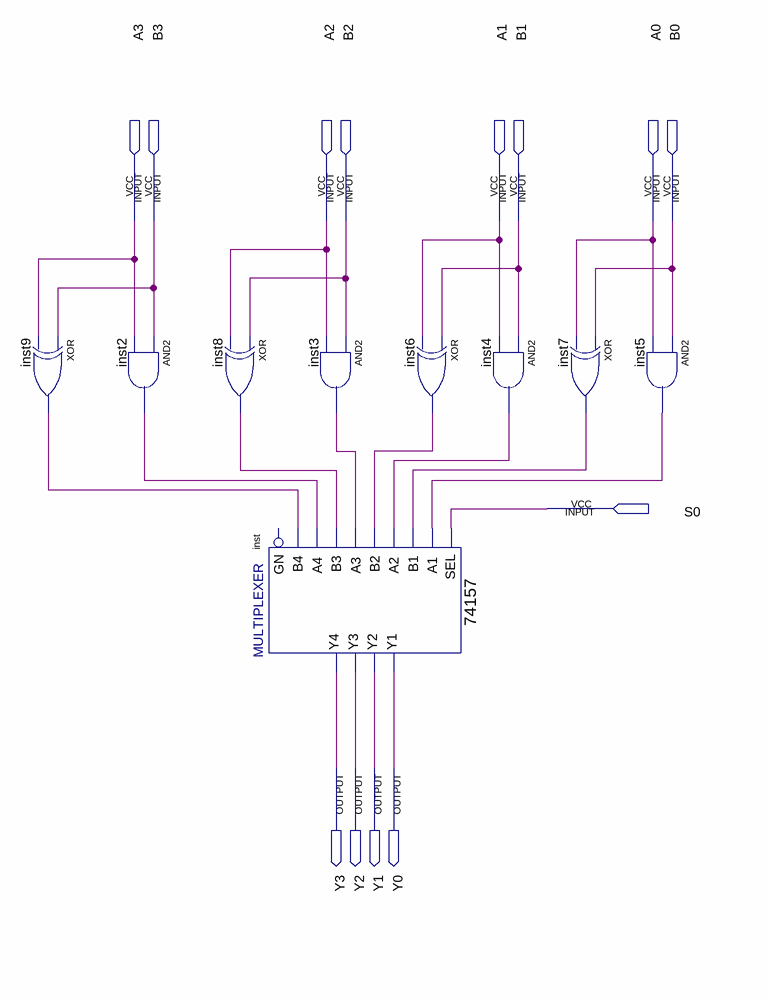
[diagram p0: schematic sheet]
// Quartus schematic AndXor.bdf as structural Verilog: 9 symbols, 13 pins
module AndXor (
  input  A3,
  input  B3,
  input  A2,
  input  B2,
  input  A1,
  input  B1,
  input  A0,
  input  B0,
  input  S0,
  output Y3,
  output Y2,
  output Y1,
  output Y0
);

  wire inst2_out, inst3_out, inst4_out, inst5_out, inst6_out, inst7_out, inst8_out, inst9_out;

  xor inst9 (inst9_out, B3, A3);
  and inst2 (inst2_out, B3, A3);
  xor inst8 (inst8_out, B2, A2);
  \74157  inst (
    .A1(inst5_out), .B1(inst7_out), .SEL(S0), .B2(inst6_out), .A3(inst3_out), .B3(inst8_out), .A2(inst4_out),
    .B4(inst9_out), .A4(inst2_out), .Y2(Y1), .Y1(Y0), .Y4(Y3), .Y3(Y2));  // open: GN
  and inst3 (inst3_out, B2, A2);
  xor inst6 (inst6_out, B1, A1);
  and inst4 (inst4_out, B1, A1);
  xor inst7 (inst7_out, B0, A0);
  and inst5 (inst5_out, B0, A0);
endmodule
